# Altium schematic sheet Sheet1.SchDoc
size A0; SheetNumber: 1; SheetTotal: 1
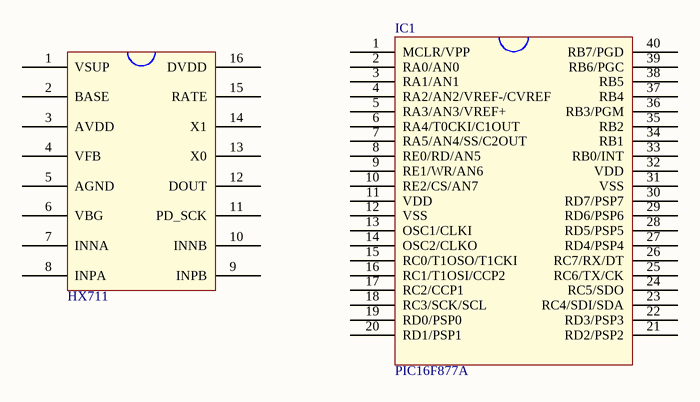
[diagram p0: Sheet1.SchDoc]

## Parts
?  HX711  [HX711]
IC1  PIC16F877A  [pic16f877a]

## Nets

Not connected (* = marked no-connect by the designer): ? 1(VSUP) 2(BASE) 3(AVDD) 4(VFB) 5(AGND) 6(VBG) 7(INNA) 8(INPA) 9(INPB) 10(INNB) 11(PD_SCK) 12(DOUT) 13(X0) 14(X1) 15(RATE) 16(DVDD); IC1 1(MCLR/VPP) 2(RA0/AN0) 3(RA1/AN1) 4(RA2/AN2/VREF-/CVREF) 5(RA3/AN3/VREF+) 6(RA4/T0CKI/C1OUT) 7(RA5/AN4/SS/C2OUT) 8(RE0/RD/AN5) 9(RE1/WR/AN6) 10(RE2/CS/AN7) 11(VDD) 12(VSS) 13(OSC1/CLKI) 14(OSC2/CLKO) 15(RC0/T1OSO/T1CKI) 16(RC1/T1OSI/CCP2) 17(RC2/CCP1) 18(RC3/SCK/SCL) 19(RD0/PSP0) 20(RD1/PSP1) 21(RD2/PSP2) 22(RD3/PSP3) 23(RC4/SDI/SDA) 24(RC5/SDO) 25(RC6/TX/CK) 26(RC7/RX/DT) 27(RD4/PSP4) 28(RD5/PSP5) 29(RD6/PSP6) 30(RD7/PSP7) 31(VSS) 32(VDD) 33(RB0/INT) 34(RB1) 35(RB2) 36(RB3/PGM) 37(RB4) 38(RB5) 39(RB6/PGC) 40(RB7/PGD)